# EAGLE design ps2_com_usb (EAGLE 9.6.2)
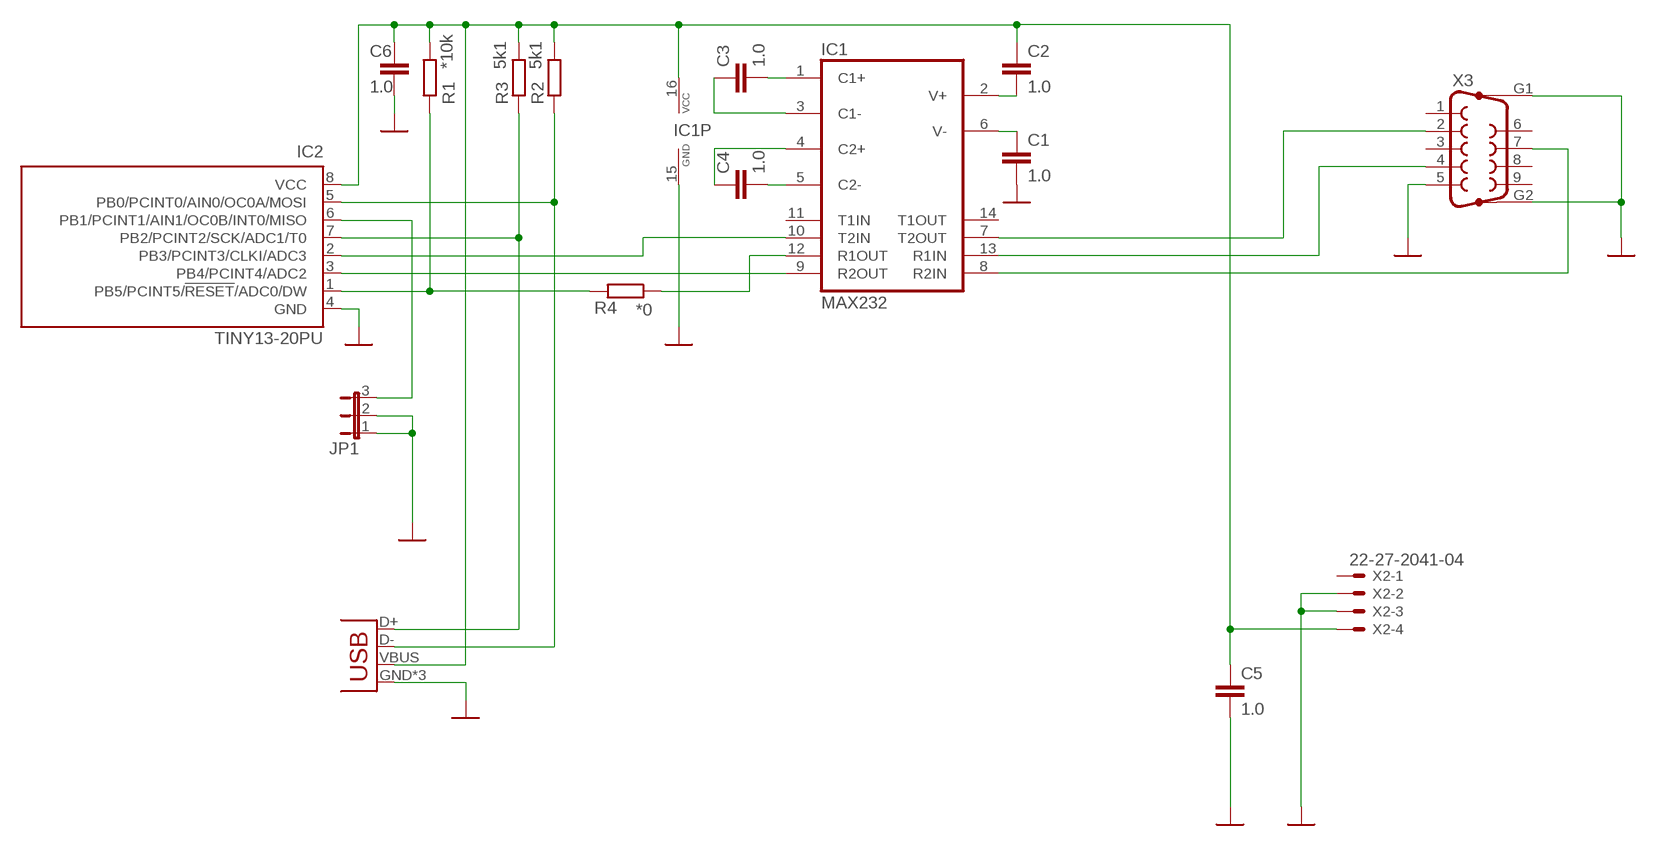
[diagram p0: schematic, sheet 1]

## Parts
C1  1.0  C-EU025-025X050  [C025-025X050]
C2  1.0  C-EU025-025X050  [C025-025X050]
C3  1.0  C-EU025-025X050  [C025-025X050]
C4  1.0  C-EU025-025X050  [C025-025X050]
C5  1.0  C-EU025-025X050  [C025-025X050]
C6  1.0  C-EU025-025X050  [C025-025X050]
IC1  MAX232  [DIL16]
IC2  TINY13-20PU  [DIL08]
JP1  JP2E  [JP2]
R1  *10k  R-EU_0204/7  [0204/7]
R2  5k1  R-EU_0204/5  [0204/5]
R3  5k1  R-EU_0204/2V  [0204V]
R4  *0  R-EU_0204/2V  [0204V]
X1  USB-A-H  [USB-A-H]
X2  22-27-2041-04  [6410-04]
X3  F09HP  [F09HP]

## Nets
CLOCK: IC2.7(PB2/PCINT2/SCK/ADC1/T0) R3.1 X1.D+
DATA: IC2.5(PB0/PCINT0/AIN0/OC0A/MOSI) R2.1 X1.D-
DTR: IC1.13(R1IN) X3.4
GND: C1.2 C5.2 C6.2 IC1.15(GND) IC2.4(GND) JP1.1 JP1.2 X1.GND X1.P$5(GND) X1.P$6(GND) X2.2 X2.3 X3.5 X3.G1 X3.G2
N$1: C4.2 IC1.5(C2-)
N$2: C4.1 IC1.4(C2+)
N$3: C3.1 IC1.3(C1-)
N$4: C3.2 IC1.1(C1+)
N$5: C1.1 IC1.6(V-)
N$6: C2.2 IC1.2(V+)
N$8: IC2.6(PB1/PCINT1/AIN1/OC0B/INT0/MISO) JP1.3
RTS: IC1.8(R2IN) X3.7
RXD: IC1.7(T2OUT) X3.2
TTL_DTR: IC1.12(R1OUT) R4.1
TTL_DTR_RST: IC2.1(PB5/PCINT5/!RESET!/ADC0/DW) R1.1 R4.2
TTL_RTS: IC1.9(R2OUT) IC2.3(PB4/PCINT4/ADC2)
TTL_RXD: IC1.10(T2IN) IC2.2(PB3/PCINT3/CLKI/ADC3)
VCC: C2.1 C5.1 C6.1 IC1.16(VCC) IC2.8(VCC) R1.2 R2.2 R3.2 X1.VBUS X2.4
Unconnected: IC1.11(T1IN) IC1.14(T1OUT) X2.1 X3.1 X3.3 X3.6 X3.8 X3.9

## Library data of the parts
C1-C6 = rcl:C-EU: CAPACITOR, European symbol; SPICEPREFIX: C
IC1 = maxim:MAX232: RS232 TRANSCEIVER; MF: MAXIM; MPN: MAX232ACPE+; OC_FARNELL: 9723773; OC_NEWARK: 68K4544
IC2 = atmel:TINY13: 8-bit AVR Microcontroller with 1K Bytes In-System Programmable Flash Source: http://www.atmel.com/dyn/resources/prod_documents/2535S.pdf; MPN: ATTINY13-20PU; OC_FARNELL: 9171550; OC_NEWARK: 96K6521
JP1 = jumper:JP2E: JUMPER
R1-R4 = rcl:R-EU_: RESISTOR, European symbol; SPICEPREFIX: R
X1 = con-usb:USB: USB Connectors
X2 = con-molex:22-?-04: CONNECTOR wire to board 2.54 mm (.1 inch) pitch header; MF: MOLEX; OC_FARNELL: unknown; OC_NEWARK: unknown
X3 = con-subd:F09HP: SUB-D; OC_FARNELL: unknown; OC_NEWARK: unknown

## Board
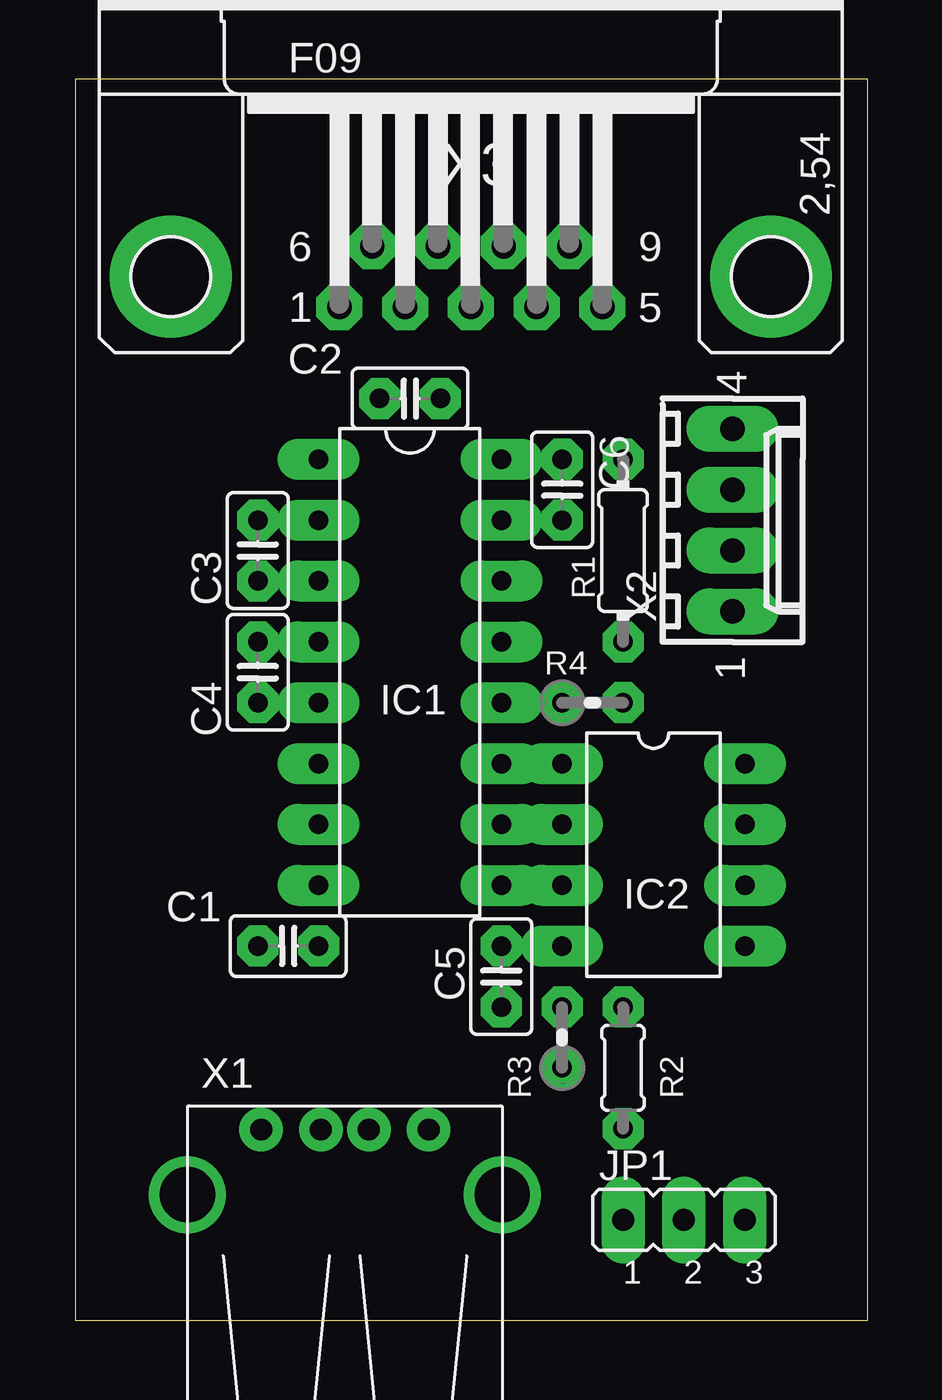
[diagram p1: board, top side]
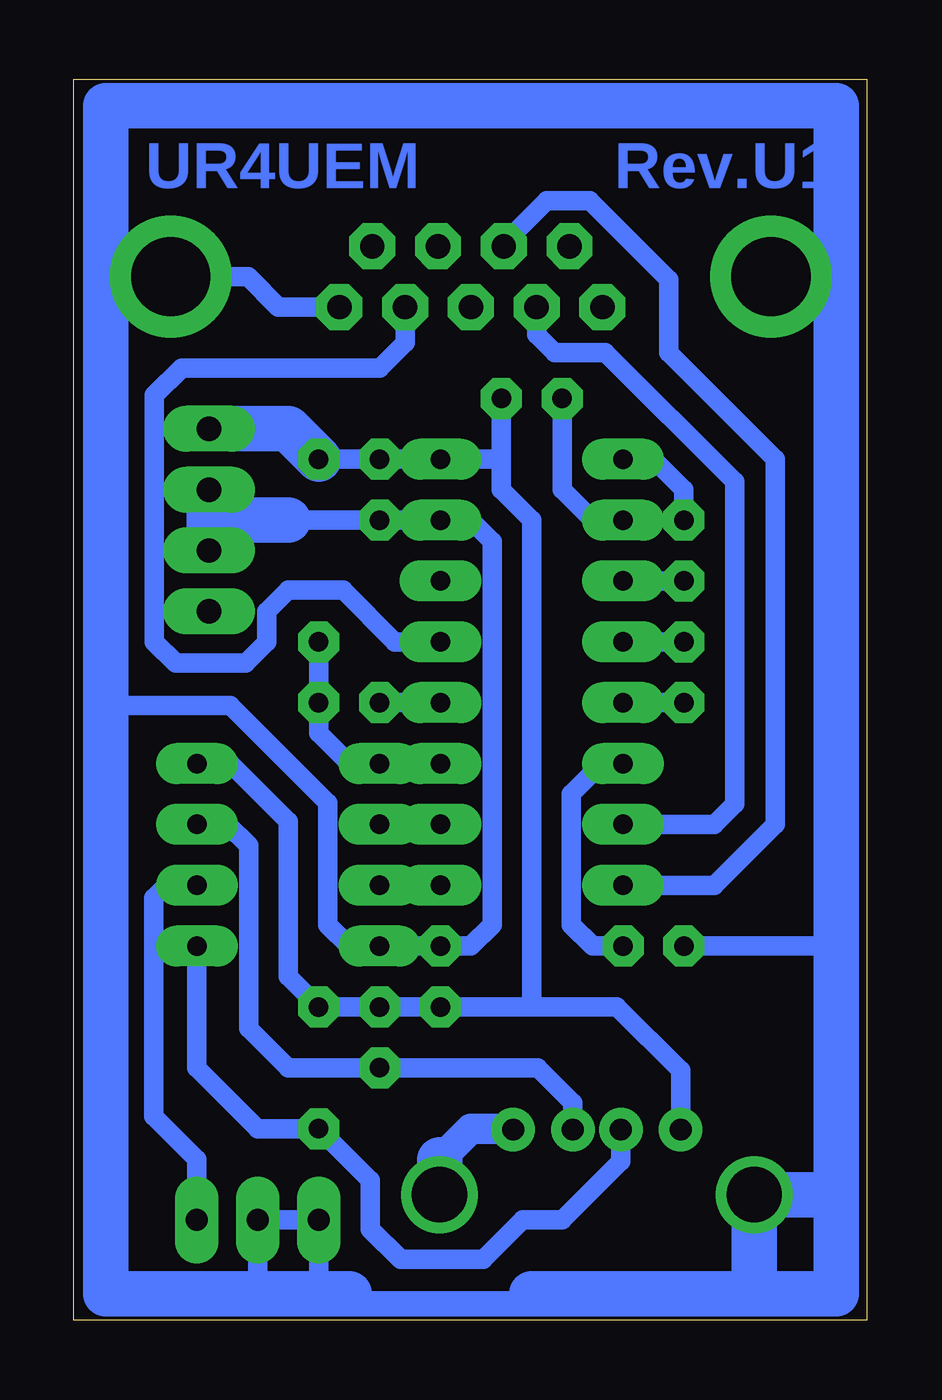
[diagram p2: board, bottom side, seen from below]

Size 33.07 x 51.81 mm. Coordinates in mm from the lower left corner, seen from the top.
Outline: 0,0 33.07,0 33.07,51.81 0,51.81 0,0
Copper layers (1*16): Top 0.035mm / dielectric 1.5mm / Bottom 0.035mm
Design rules "fab_board": minimum track width 0.3mm, minimum drill 0.6mm, track to track 0.15mm, track to pad 0.15mm, pad to pad 0.15mm, via to via 0.15mm, smd to smd 0.15mm, copper to edge 0.15mm, drill to drill 0.15mm, minimum pad ring 0.45mm, minimum via ring 0.45mm, stop-mask expansion 4mil, vias tented up to drill 0mil, thermal gap 0.5mm

### Footprints (pad centres in the part's own frame; a part is rotated, then mirrored left to right if it is on the bottom)
C025-025X050 = drill 0.813 octagon: 1 -1.27,0; 2 1.27,0
DIL16 = drill 0.813 long: 1 -8.89,-3.81; 2 -6.35,-3.81; 3 -3.81,-3.81; 4 -1.27,-3.81; 5 1.27,-3.81; 6 3.81,-3.81; 7 6.35,-3.81; 8 8.89,-3.81; 9 8.89,3.81; 10 6.35,3.81; 11 3.81,3.81; 12 1.27,3.81; 13 -1.27,3.81; 14 -3.81,3.81; 15 -6.35,3.81; 16 -8.89,3.81
DIL08 = drill 0.813 long: 1 -3.81,-3.81; 2 -1.27,-3.81; 3 1.27,-3.81; 4 3.81,-3.81; 5 3.81,3.81; 6 1.27,3.81; 7 -1.27,3.81; 8 -3.81,3.81
JP2 = drill 0.914 long: 1 -2.54,0; 2 0,0; 3 2.54,0
0204/7 = drill 0.813 octagon: 1 -3.81,0; 2 3.81,0
0204/5 = drill 0.813 octagon: 1 -2.54,0; 2 2.54,0
0204V = drill 0.813 octagon: 1 -1.27,0; 2 1.27,0
USB-A-H = drill 0.914: D+ 2.718,-1.003; D- 2.718,1.003; GND 2.718,-3.493; VBUS 2.718,3.493 | drill 2.311: P$5 0,-6.566; P$6 0,6.566
6410-04 = drill 1.016 long: 1 3.81,0; 2 1.27,0; 3 -1.27,0; 4 -3.81,0
F09HP = drill 1.016 octagon: 1 -5.486,-1.27; 2 -2.743,-1.27; 3 0,-1.27; 4 2.743,-1.27; 5 5.486,-1.27; 6 -4.115,1.27; 7 -1.372,1.27; 8 1.372,1.27; 9 4.115,1.27 | drill 3.302 pad 5.08: G1 -12.522,0; G2 12.522,0

### Placement (x,y rotation side)
C1  8.89,15.62 180 top
C2  13.97,38.48 180 top
C3  7.62,32.13 90 top
C4  7.62,27.05 270 top
C5  17.78,14.35 90 top
C6  20.32,34.67 270 top
IC1  13.97,27.05 270 top
IC2  24.13,19.43 270 top
JP1  25.4,4.19 0 top
R1  22.86,32.13 90 top
R2  22.86,10.54 90 top
R3  20.32,11.81 90 top
R4  21.59,25.78 0 top
X1  11.25,5.25 90 top
X2  27.43,33.4 270 top
X3  16.51,43.56 0 top

### Tracks (layer width: path | path; a pad name or v marks a point on that pad's centre or on a via)
CLOCK
  Bottom 0.813: IC2.7 26.67,20.7 25.78,19.81 25.78,12.19 24.13,10.54 R3.1 13.71,10.54 12.26,9.09 X1.D+
DATA
  Bottom 0.813: IC2.5 27.94,10.54 25.4,8 R2.1 20.7,5.84 20.7,3.81 19.43,2.54 16,2.54 14.35,4.19 12.7,4.19 10.25,6.64 X1.D-
DTR
  Bottom 0.813: X3.4 19.25,40.82 20.32,39.75 28.57,39.75 29.72,38.61 29.72,28.32 28.83,27.43 25.91,27.43 25.02,28.32 25.02,29.59 24.13,30.48 21.84,30.48 19.68,28.32 IC1.13
GND
  Bottom 0.813: X3.5 24.54,42.29 25.81,43.56 X3.G2 | C1.2 1.27,15.62 | 31.75,25.65 26.54,25.65 22.48,21.59 22.48,16.51 21.59,15.62 IC2.4 C5.2 16.51,15.62 15.62,16.51 15.62,32.51 16.51,33.4 IC1.15 C6.2 24.13,33.4 | 13.97,1.1 13.97,0.68 | 21.59,1.1 21.59,0.68 | 22.86,1.1 JP1.1 JP1.2 25.4,1.1 | 4.69,1.98 3.81,1.1 | X1.GND 14.78,8
  Bottom 1.067: 13.97,0.68 21.59,0.68
  Bottom 1.27: 14.78,8 16.51,8 17.82,6.69
  Bottom 1.905: X2.2 27.43,33.4 | 27.43,33.4 X2.3 | X3.G1 1.27,43.56 | 1.27,43.56 1.27,15.62 1.27,5.46 | X3.G2 31.75,43.56 | 31.75,43.56 31.75,25.65 31.75,1.1 25.4,1.1 22.86,1.1 21.59,1.1 | 24.13,33.4 27.43,33.4 | 1.27,43.56 1.27,50.7 31.75,50.7 31.75,43.56 | 13.97,1.1 3.81,1.1 1.27,1.1 1.27,5.46 | 1.27,5.46 1.49,5.24 X1.P$6 4.69,1.98 | 17.82,6.69 X1.P$5
N$1
  Bottom 0.813: C4.2 IC1.5
N$2
  Bottom 0.813: C4.1 IC1.4
N$3
  Bottom 0.813: C3.1 IC1.3
N$4
  Bottom 0.813: C3.2 7.62,34.67 8.89,35.94 IC1.1
N$5
  Bottom 0.813: IC1.6 11.05,23.24 12.32,21.97 12.32,16.51 11.43,15.62 C1.1
N$6
  Bottom 0.813: IC1.2 11.43,33.4 12.7,34.67 C2.2
N$8
  Bottom 0.813: IC2.6 29.21,18.16 29.73,17.64 29.73,8.52 27.94,6.73 JP1.3
RTS
  Bottom 0.813: X3.7 15.14,44.93 13.34,46.74 11.56,46.74 8.26,43.43 8.26,40.39 3.81,35.94 3.81,20.7 6.35,18.16 IC1.8
RXD
  Bottom 0.813: X3.2 13.77,41.15 13.01,40.4 10.9,40.4 5.51,35.01 5.51,21.54 6.35,20.7 IC1.7
TTL_DTR
  Bottom 0.813: IC1.12 R4.1
TTL_DTR_RST
  Bottom 0.813: IC2.1 21.59,23.24 22.86,24.51 R4.2 R1.1
TTL_RTS
  Bottom 0.813: IC1.9 IC2.3
TTL_RXD
  Bottom 0.813: IC1.10 IC2.2
VCC
  Bottom 0.813: R1.2 C6.1 IC1.16 15.24,35.94 | 13.97,13.08 13.97,33.4 15.24,34.67 15.24,35.94 | 15.24,35.94 C2.1 | 13.97,13.08 C5.1 R3.2 R2.2 24.13,14.35 24.13,20.83 26.54,23.24 IC2.8 | 13.97,13.08 10.41,13.08 7.76,10.43 X1.VBUS
  Bottom 1.905: R1.2 24.13,37.21 X2.4

### Text on the board
Bottom: Rev.U1 | UR4UEM